# Altium schematic sheet powerS.SchDoc
size A4; DocumentNumber: 2; SheetNumber: 2; SheetTotal: 3
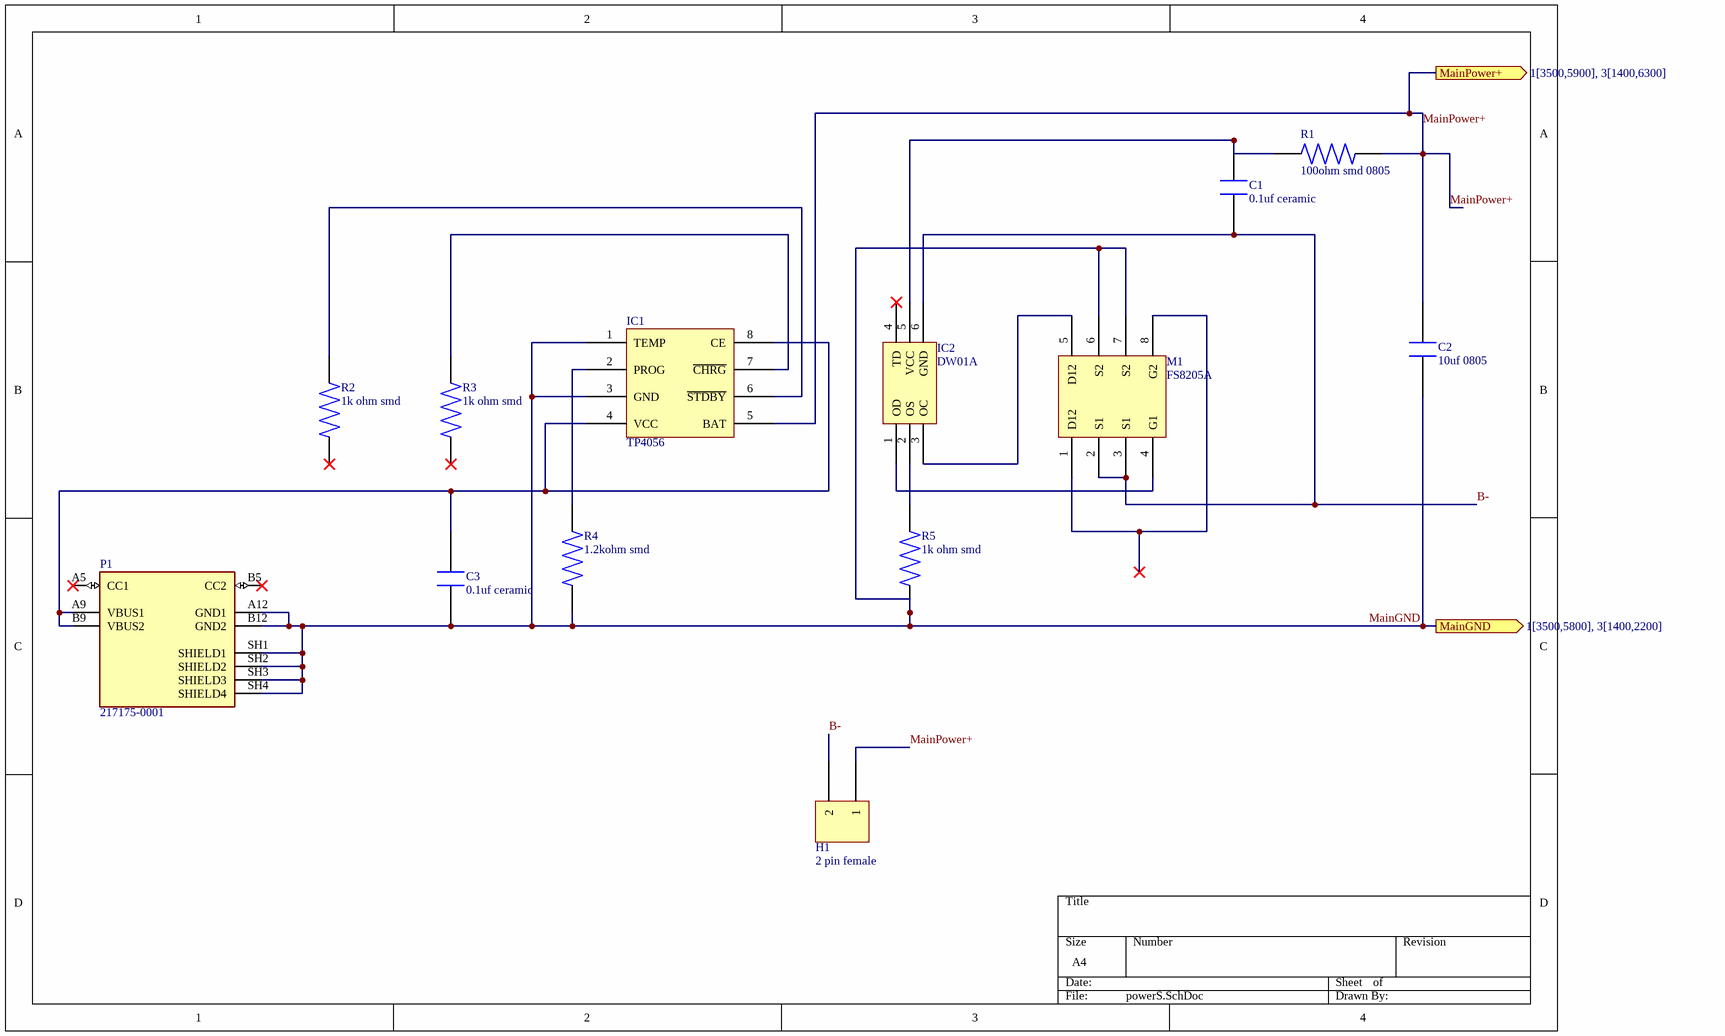
[diagram p0: powerS.SchDoc]

## Parts
C1  0.1uf ceramic  [Capacitor]
C2  10uf 0805  [0805 SMD]
C3  0.1uf ceramic  [Capacitor]
H1  2 pin female  [2 pin female]
IC1  TP4056  [TP 4056]
IC2  DW01A  [DW01]
M1  FS8205A  [FS8205A]
P1  217175-0001  [usb type C]
R1  100ohm smd 0805  [0805 SMD]
R2  1k ohm smd  [0805 SMD]
R3  1k ohm smd  [0805 SMD]
R4  1.2kohm smd  [0805 SMD]
R5  1k ohm smd  [0805 SMD]

## Ports
MainGND (out, see 1[3500,5800], 3[1400,2200]), MainPower+ (out, see 1[3500,5900], 3[1400,6300])

## Nets
B-: C1.1 H1.2 IC2.6(GND) M1.2(S1) M1.3(S1)
MainGND: C2.1 C3.1 IC1.1(TEMP) IC1.3(GND) M1.6(S2) M1.7(S2) P1.A12(GND1) P1.B12(GND2) P1.SH1(SHIELD1) P1.SH2(SHIELD2) P1.SH3(SHIELD3) P1.SH4(SHIELD4) R4.2 R5.1 ; port MainGND
MainPower+: C2.2 H1.1 IC1.5(BAT) R1.2 ; port MainPower+
NetC1_2: C1.2 IC2.5(VCC) R1.1
NetC3_2: C3.2 IC1.4(VCC) IC1.8(CE) P1.A9(VBUS1) P1.B9(VBUS2)
NetIC1_2: IC1.2(PROG) R4.1
NetIC1_6: IC1.6(~{STDBY}) R2.2
NetIC1_7: IC1.7(~{CHRG}) R3.2
NetIC2_1: IC2.1(OD) M1.4(G1)
NetIC2_2: IC2.2(OS) R5.2
NetIC2_3: IC2.3(OC) M1.5(D12)
NetM1_1: M1.1(D12) M1.8(G2)

Not connected (* = marked no-connect by the designer): IC2 4(TD)*; P1 A5(CC1)* B5(CC2)*; R2 1*; R3 1*

## Library data of the parts
C1 C3 = K104K15X7RF5TL2: Ceramic Capacitor, Multilayer, Ceramic, 50V, 10% +Tol, 10% -Tol, X7R, 15% TC, 0.1uF, Through Hole Mount; Manufacturer: Vishay BCcomponents; Value: 100nF; Multilayer: Yes; Supplier: Mouser; Supplier Part Number: 594-K104K15X7RF5TL2; Manufacturer Part Number: K104K15X7RF5TL2; RoHS: Yes; Category: Ceramic Capacitors; Stock: 25637; Pricing: 1=0.25, 10=0.134, 50=0.134, 100=0.093, 1000=0.066, 10000=0.048 (USD); Mounting Technology: Through Hole; Pins: 2; Dielectric Material: Ceramic; Package Shape: Rectangular; Terminal Finish: Tin; Min Operating Temperature: -55°C; Max Operating Temperature: 125°C; JESD-609 Code: e3; Capacitor Type: Ceramic; Tolerance  (fill in as +-): 10%; Package Style: RadialMeter; Packaging: Tape and Reel; Tolerance (fill in as +-): 10%; Rated DC Voltage (URdc): 50V; Temperature Characteristics Code: X7R; Termination: Wire; Length: 4mm; Width: 2.5mm; Height: 5.58mm; Terminal Pitch: 2.5mm; Reach SVHC Compliant: Yes; RoHS Compliant: Yes; ComponentLink1URL: https://datasheet.ciiva.com:443/pdfs/VipMasterIC/IC/VISH/VISHS88539/VISHS88539-1.pdf?src-supplier=IHS+Markit; ComponentLink1Description: https://datasheet.ciiva.com:443/pdfs/VipMasterIC/IC/VISH/VISHS88539/VISHS88539-1.pdf?src-supplier=IHS+Markit; ComponentLink2URL: https://datasheet.ciiva.com/5711/5950-5711596.pdf?src-supplier=Farnell; ComponentLink2Description: https://datasheet.ciiva.com/5711/5950-5711596.pdf?src-supplier=Farnell; ComponentLink3URL: https://datasheet.ciiva.com/3777/kseries-3777922.pdf?src-supplier=Arrow+Electronics; ComponentLink3Description: https://datasheet.ciiva.com/3777/kseries-3777922.pdf?src-supplier=Arrow+Electronics; ComponentLink4URL: https://datasheet.ciiva.com/15165/getdatasheetpartid-35651-15165099.pdf?src-supplier=Verical; ComponentLink4Description: https://datasheet.ciiva.com/15165/getdatasheetpartid-35651-15165099.pdf?src-supplier=Verical; ComponentLink5URL: https://datasheet.ciiva.com/145/kseries-145889.pdf?src-supplier=Digikey; ComponentLink5Description: https://datasheet.ciiva.com/145/kseries-145889.pdf?src-supplier=Digikey; ComponentLink6URL: https://datasheet.ciiva.com/145/kseries-145890.pdf?src-supplier=Digikey; ComponentLink6Description: https://datasheet.ciiva.com/145/kseries-145890.pdf?src-supplier=Digikey; ComponentLink7URL: https://datasheet.ciiva.com/5390/mkseries-205465-5390374.pdf?src-supplier=Mouser; ComponentLink7Description: https://datasheet.ciiva.com/5390/mkseries-205465-5390374.pdf?src-supplier=Mouser; ComponentLink8URL: https://datasheet.ciiva.com/7974/5950-7974781.pdf?src-supplier=Element14; ComponentLink8Description: https://datasheet.ciiva.com/7974/5950-7974781.pdf?src-supplier=Element14; ComponentLink9URL: https://datasheet.ciiva.com/18446/70121924-18446217.pdf?src-supplier=Allied+Electronics; ComponentLink9Description: https://datasheet.ciiva.com/18446/70121924-18446217.pdf?src-supplier=Allied+Electronics
C2 = GRM21BR61C106KE15K: Ceramic Capacitor, Multilayer, Ceramic, 16V, 10% +Tol, 10% -Tol, X5R, 15% TC, 10uF, Surface Mount, 0805; Manufacturer: Murata; Multilayer: Yes; Supplier: Mouser; Supplier Part Number: 81-GRM21BR61C106KE5K; Manufacturer Part Number: GRM21BR61C106KE15K; RoHS: Yes; Category: Ceramic Capacitors; Stock: 207282; Pricing: 1=0.14, 10=0.073, 50=0.073, 100=0.044, 1000=0.03, 10000=0.019 (USD); Mounting Technology: Surface Mount; Pins: 2; Dielectric Material: Ceramic; Package Shape: Rectangular; Case/Package: 0805; Terminal Finish: Nickel; Min Operating Temperature: -55°C; Max Operating Temperature: 85°C; JESD-609 Code: e3; Value: 10uF; Capacitor Type: Ceramic; Tolerance  (fill in as +-): 10%; Package Style: SMTMeter; Packaging: Tape and Reel; Tolerance (fill in as +-): 10%; Rated DC Voltage (URdc): 16V; Temperature Characteristics Code: X5R; Termination: Wraparound; Length: 2mm; Width: 1.25mm; Height: 1.25mm; Reach SVHC Compliant: Yes; RoHS Compliant: Yes; ComponentLink1URL: https://psearch.en.murata.com:443/capacitor/product/GRM21BR61C106KE15%23.pdf?src-supplier=IHS+Markit; ComponentLink1Description: https://psearch.en.murata.com:443/capacitor/product/GRM21BR61C106KE15%23.pdf?src-supplier=IHS+Markit; ComponentLink2URL: https://datasheet.ciiva.com/26822/getdatasheetpartid-31687-26822939.pdf?src-supplier=Verical; ComponentLink2Description: https://datasheet.ciiva.com/26822/getdatasheetpartid-31687-26822939.pdf?src-supplier=Verical; ComponentLink3URL: https://datasheet.ciiva.com/5414/product-5414934.pdf?src-supplier=Mouser; ComponentLink3Description: https://datasheet.ciiva.com/5414/product-5414934.pdf?src-supplier=Mouser; ComponentLink4URL: https://datasheet.ciiva.com/6270/partnumbering-e-01-6270407.pdf?src-supplier=Digikey; ComponentLink4Description: https://datasheet.ciiva.com/6270/partnumbering-e-01-6270407.pdf?src-supplier=Digikey; ComponentLink5URL: https://datasheet.ciiva.com/6270/partnumbering-e-01-6270410.pdf?src-supplier=Digikey; ComponentLink5Description: https://datasheet.ciiva.com/6270/partnumbering-e-01-6270410.pdf?src-supplier=Digikey; ComponentLink6URL: https://datasheet.ciiva.com/6270/partnumbering-e-01-6270412.pdf?src-supplier=Digikey; ComponentLink6Description: https://datasheet.ciiva.com/6270/partnumbering-e-01-6270412.pdf?src-supplier=Digikey
H1 = 22-02-2025: Board Connector, 2 Contact(s), 1 Row(s), Female, Straight, 0.1 inch Pitch, Solder Terminal, Plug; Manufacturer: Molex; Option: General Purpose; Board Mounting Option: PCB EDGE LOCKING HOOK; Contact Pattern: RECTANGULAR; Contact Resistance: 20mR; Contact Style: BELLOWED TYPE; Dielectric Withstanding Voltage (AC): 250V; Durability: 25Cycles; Filter Feature: No; Insertion Force-Max: 2.502N; Insulation Resistance: 500GR; Mating Information: MULTIPLE MATING PARTS AVAILABLE; Number Of Connectors: 1; Rated Current (Signal): 2.5A; Number of Contacts: 2; Withdrawl Force-Min: 0.834N; Body Breadth: 0.318inch; Body Depth: 0.31inch; Body Length: 0.196inch; Reference Standard: UL; Reliability: COMMERCIAL; Supplier: Mouser; Supplier Part Number: 538-22-02-2025; Manufacturer Part Number: 22-02-2025; RoHS: Yes; Category: Headers and Wire Housings; Stock: 7398; Pricing: 1=0.28, 10=0.242, 50=0.206, 100=0.188, 1000=0.157, 10000=0.123 (USD); Mounting Technology: Board; Contact Finish - Mating: NOT SPECIFIED; Insulation Material: Nylon; Min Operating Temperature: -40°C; Max Operating Temperature: 105°C; Connector Type: BOARD CONNECTOR; Body/Shell Style: PLUG; Contact Gender: Female; Mixed Contacts: No; Mounting Style: STRAIGHT; Number Of PCB Rows: 1; Number of Rows Loaded: 1; PCB Contact Pattern: RECTANGULAR; Termination: Solder; Mating Contact Pitch: 0.1inch; Terminal Length: 0.133inch; Terminal Pitch: 2.54mm; Flammability Rating: UL94 V-0; DIN Conformance: No; IEC Conformance: No; MIL Conformance: No; Reach SVHC Compliant: Yes; RoHS Compliant: Yes; ComponentLink1URL: https://datasheet.ciiva.com:443/pdfs/VipMasterIC/IC/MOLE/MOLE-S-A0003536749/MOLE-S-A0003534645-1.pdf?src-supplier=IHS+Markit; ComponentLink1Description: https://datasheet.ciiva.com:443/pdfs/VipMasterIC/IC/MOLE/MOLE-S-A0003536749/MOLE-S-A0003534645-1.pdf?src-supplier=IHS+Markit; ComponentLink2URL: https://datasheet.ciiva.com/15175/getdatasheetpartid-31375-15175253.pdf?src-supplier=Verical; ComponentLink2Description: https://datasheet.ciiva.com/15175/getdatasheetpartid-31375-15175253.pdf?src-supplier=Verical; ComponentLink3URL: https://datasheet.ciiva.com/30151/52630022022025-pcb-receptacles-30151741.pdf?src-supplier=Onlinecomponents.com; ComponentLink3Description: https://datasheet.ciiva.com/30151/52630022022025-pcb-receptacles-30151741.pdf?src-supplier=Onlinecomponents.com
IC1 = TP4057: Manufacturer: Revvo; Supplier: Digikey; Supplier Part Number: 5272-TP4057CT-ND; Manufacturer Part Number: TP4057; RoHS: No; Stock: 1917; Pricing: 1=0.45, 10=0.269, 25=0.2196, 100=0.1645, 250=0.13732, 500=0.1206, 1000=0.10656 (USD)
IC2 = CDSOT236-0504C: Trans Voltage Suppressor Diode, 5V V(RWM), Unidirectional, 1 Element, Silicon; Manufacturer: Bourns; Package Body Material: Plastic; Min Breakdown Voltage: 6V; Number of Elements: 1; Qualification Status: Not Qualified; Supplier: Digikey; Supplier Part Number: CDSOT236-0504CCT-ND; Manufacturer Part Number: CDSOT236-0504C; RoHS: Yes; Category: TVS Diodes; Stock: 7352; Pricing: 1=1.33, 10=1.05, 100=0.738, 500=0.569, 1000=0.549 (USD); Pins: 6; Diode Element Material: SILICON; Package Shape: Rectangular; Terminal Finish: Tin; JESD-609 Code: e3; Polarity: Unidirectional; Diode Type: TRANS VOLTAGE SUPPRESSOR; JESD-30 Code: R-PDSO-G6; Moisture Sensitivity Level: 1; Package Style: SMALL OUTLINEMeter; Rep Pk Reverse Voltage-Max: 5V; Surface Mount: Yes; Technology: AVALANCHE; Terminal Form: Gull Wing; Terminal Position: DUAL; Reach SVHC Compliant: Yes; RoHS Compliant: Yes; ComponentLink1URL: https://datasheet.ciiva.com:443/pdfs/VipMasterIC/IC/BOUR/BOUR-S-A0008954902/BOUR-S-A0008954902-1.pdf?src-supplier=IHS+Markit; ComponentLink1Description: https://datasheet.ciiva.com:443/pdfs/VipMasterIC/IC/BOUR/BOUR-S-A0008954902/BOUR-S-A0008954902-1.pdf?src-supplier=IHS+Markit; ComponentLink2URL: https://datasheet.ciiva.com/4510/cdsot236-0504c-29206-4510980.pdf?src-supplier=Mouser; ComponentLink2Description: https://datasheet.ciiva.com/4510/cdsot236-0504c-29206-4510980.pdf?src-supplier=Mouser; ComponentLink3URL: https://datasheet.ciiva.com/11193/cdsot236-0504c-11193748.pdf?src-supplier=Avnet; ComponentLink3Description: https://datasheet.ciiva.com/11193/cdsot236-0504c-11193748.pdf?src-supplier=Avnet; ComponentLink4URL: https://datasheet.ciiva.com/1281/1-1281335.pdf?src-supplier=Farnell; ComponentLink4Description: https://datasheet.ciiva.com/1281/1-1281335.pdf?src-supplier=Farnell; ComponentLink5URL: https://datasheet.ciiva.com/6574/cdsot236-0504c-6574181.pdf?src-supplier=Digikey; ComponentLink5Description: https://datasheet.ciiva.com/6574/cdsot236-0504c-6574181.pdf?src-supplier=Digikey; ComponentLink6URL: https://datasheet.ciiva.com/6574/cdsot236-0504c-6574182.pdf?src-supplier=Digikey; ComponentLink6Description: https://datasheet.ciiva.com/6574/cdsot236-0504c-6574182.pdf?src-supplier=Digikey; ComponentLink7URL: https://datasheet.ciiva.com/15186/getdatasheetpartid-569616-15186666.pdf?src-supplier=Verical; ComponentLink7Description: https://datasheet.ciiva.com/15186/getdatasheetpartid-569616-15186666.pdf?src-supplier=Verical; ComponentLink8URL: https://datasheet.ciiva.com/1276/1-1276716.pdf?src-supplier=Element14; ComponentLink8Description: https://datasheet.ciiva.com/1276/1-1276716.pdf?src-supplier=Element14; ComponentLink9URL: https://datasheet.ciiva.com/6574/cdsot236-0504c-6574183.pdf?src-supplier=Digikey; ComponentLink9Description: https://datasheet.ciiva.com/6574/cdsot236-0504c-6574183.pdf?src-supplier=Digikey
M1 = FDMQ8205A: Small Signal Field-Effect Transistor, 1.7A I(D), 4-Element, N-Channel and P-Channel, Silicon, Metal-oxide Semiconductor FET; Manufacturer: ON Semiconductor / Fairchild; Supplier: Digikey; Supplier Part Number: FDMQ8205AOSCT-ND; Manufacturer Part Number: FDMQ8205A; RoHS: Yes; Category: Uncategorized; Stock: 2203; Pricing: 1=4.3, 10=2.833, 100=2.0004, 500=1.64488, 1000=1.5307 (USD); ComponentLink1URL: https://datasheet.ciiva.com:443/pdfs/VipMasterIC/IC/ONSM/ONSM-S-A0003590974/ONSM-S-A0003590675-1.pdf?src-supplier=IHS+Markit; ComponentLink1Description: https://datasheet.ciiva.com:443/pdfs/VipMasterIC/IC/ONSM/ONSM-S-A0003590974/ONSM-S-A0003590675-1.pdf?src-supplier=IHS+Markit; ComponentLink2URL: http://www.farnell.com/datasheets/2724479.pdf?src-supplier=Farnell; ComponentLink2Description: http://www.farnell.com/datasheets/2724479.pdf?src-supplier=Farnell; ComponentLink3URL: http://www.onsemi.com/pub/Collateral/FDMQ8205A-D.pdf?src-supplier=Digikey; ComponentLink3Description: http://www.onsemi.com/pub/Collateral/FDMQ8205A-D.pdf?src-supplier=Digikey; ComponentLink4URL: http://www.farnell.com/datasheets/2724479.pdf?src-supplier=Newark; ComponentLink4Description: http://www.farnell.com/datasheets/2724479.pdf?src-supplier=Newark
P1 = 217175-0001: USB Type C - Connector, Top-mount, SMT, 6pos | Molex Incorporated 217175-0001; Supplier: Arrow Electronics; Supplier Part Number: 217175-0001; Manufacturer: Molex; Manufacturer Part Number: 217175-0001; RoHS: No; Category: Connectors; Stock: 4503; Pricing: 1=0.7777, 10=0.6391, 25=0.5562, 100=0.5234, 250=0.4834, 500=0.4331, 1000=0.3654, 4000=0.3393 (USD)
R1 = ERJ-6ENF1000V: Fixed Resistor, Metal Glaze/thick Film, 0.125W, 100ohm, 150V, 1% +/-Tol, 100ppm/Cel, Surface Mount, 0805; Manufacturer: Panasonic; Power: 125mW; Rated Temperature: 70°C; Value: 100R; Temperature Coefficient (ppm/Cel): 100; Package Height: 0.6mm; Package Length: 2mm; Package Width: 1.25mm; Reference Standard: AEC-Q200; Supplier: Mouser; Supplier Part Number: 667-ERJ-6ENF1000V; Manufacturer Part Number: ERJ-6ENF1000V; RoHS: Yes; Category: Chip SMD Resistors; Stock: 326427; Pricing: 1=0.11, 10=0.053, 50=0.053, 100=0.028, 1000=0.017, 10000=0.01 (USD); Mounting Technology: Surface Mount; Pins: 2; Package Shape: Rectangular; Case/Package: 0805; Terminal Finish: Nickel; Min Operating Temperature: -55°C; Max Operating Temperature: 155°C; Tolerance: 1%; JESD-609 Code: e3; Resistor Type: FIXED RESISTOR; Construction: Rectangular; Packaging: Tape and Reel; Technology: METAL GLAZE/THICK FILM; Termination: Wraparound; Working Voltage: 150V; Reach SVHC Compliant: Yes; RoHS Compliant: Yes; ComponentLink1URL: https://datasheet.ciiva.com:443/pdfs/VipMasterIC/IC/PANA/PANA-S-A0009889626/PANA-S-A0009889626-1.pdf?src-supplier=IHS+Markit; ComponentLink1Description: https://datasheet.ciiva.com:443/pdfs/VipMasterIC/IC/PANA/PANA-S-A0009889626/PANA-S-A0009889626-1.pdf?src-supplier=IHS+Markit; ComponentLink2URL: https://datasheet.ciiva.com/11808/0900766b80f80784-11808206.pdf?src-supplier=Rs; ComponentLink2Description: https://datasheet.ciiva.com/11808/0900766b80f80784-11808206.pdf?src-supplier=Rs; ComponentLink3URL: https://datasheet.ciiva.com/9186/aoa0000ce2-9186686.pdf?src-supplier=Avnet; ComponentLink3Description: https://datasheet.ciiva.com/9186/aoa0000ce2-9186686.pdf?src-supplier=Avnet; ComponentLink4URL: https://datasheet.ciiva.com/30154/aoa0000ce2-30154938.pdf?src-supplier=Onlinecomponents.com; ComponentLink4Description: https://datasheet.ciiva.com/30154/aoa0000ce2-30154938.pdf?src-supplier=Onlinecomponents.com; ComponentLink5URL: https://datasheet.ciiva.com/46419/1678782-46419878.pdf?src-supplier=Element14; ComponentLink5Description: https://datasheet.ciiva.com/46419/1678782-46419878.pdf?src-supplier=Element14; ComponentLink6URL: https://datasheet.ciiva.com/7830/426256-7830744.pdf?src-supplier=Element14; ComponentLink6Description: https://datasheet.ciiva.com/7830/426256-7830744.pdf?src-supplier=Element14; ComponentLink7URL: https://datasheet.ciiva.com/7830/1678782-7830986.pdf?src-supplier=Element14; ComponentLink7Description: https://datasheet.ciiva.com/7830/1678782-7830986.pdf?src-supplier=Element14; ComponentLink8URL: https://datasheet.ciiva.com/16765/70260748-16765594.pdf?src-supplier=Allied+Electronics; ComponentLink8Description: https://datasheet.ciiva.com/16765/70260748-16765594.pdf?src-supplier=Allied+Electronics
R2 R3 R5 = RNCP0805FTD1K00: Fixed Resistor, Thin Film, 0.25W, 1000ohm, 200V, 1% +/-Tol, 100ppm/Cel, Surface Mount, 0805; Manufacturer: Stackpole Electronics; Additional Feature: ANTI-SULFUR; Power: 250mW; Rated Temperature: 70°C; Value: 1kR; Temperature Coefficient (ppm/Cel): 100; Package Height: 0.5mm; Package Length: 2mm; Package Width: 1.25mm; Supplier: Digikey; Supplier Part Number: RNCP0805FTD1K00CT-ND; Manufacturer Part Number: RNCP0805FTD1K00; RoHS: Yes; Category: Chip SMD Resistors; Stock: 258243; Pricing: 1=0.1, 10=0.015, 50=0.013, 100=0.0101 (USD); Mounting Technology: Surface Mount; Pins: 2; Package Shape: Rectangular; Case/Package: 0805; Terminal Finish: Nickel; Min Operating Temperature: -55°C; Max Operating Temperature: 155°C; Tolerance: 1%; JESD-609 Code: e3; Resistor Type: FIXED RESISTOR; Construction: Chip; Packaging: Tape and Reel; Technology: THIN FILM; Termination: Wraparound; Working Voltage: 200V; Reach SVHC Compliant: Yes; RoHS Compliant: Yes; ComponentLink1URL: https://datasheet.ciiva.com:443/pdfs/VipMasterIC/IC/SEIE/SEIE-S-A0009893778/SEIE-S-A0009893778-1.pdf?src-supplier=IHS+Markit; ComponentLink1Description: https://datasheet.ciiva.com:443/pdfs/VipMasterIC/IC/SEIE/SEIE-S-A0009893778/SEIE-S-A0009893778-1.pdf?src-supplier=IHS+Markit; ComponentLink2URL: http://www.seielect.com/Catalog/SEI-rncp.pdf?src-supplier=Future+Electronics; ComponentLink2Description: http://www.seielect.com/Catalog/SEI-rncp.pdf?src-supplier=Future+Electronics; ComponentLink3URL: https://www.seielect.com/catalog/SEI-Packaging.pdf?src-supplier=Digikey; ComponentLink3Description: https://www.seielect.com/catalog/SEI-Packaging.pdf?src-supplier=Digikey; ComponentLink4URL: https://www.seielect.com/Catalog/SEI-rncp.pdf?src-supplier=Digikey; ComponentLink4Description: https://www.seielect.com/Catalog/SEI-rncp.pdf?src-supplier=Digikey
R4 = CRGCQ0805F1K2: Fixed Resistor, Metal Glaze/thick Film, 0.125W, 1200ohm, 150V, 1% +/-Tol, 100ppm/Cel, Surface Mount, 0805; Manufacturer: TE Connectivity; Supplier: Digikey; Supplier Part Number: A129750CT-ND; Manufacturer Part Number: CRGCQ0805F1K2; RoHS: Yes; Category: Chip SMD Resistors; Stock: 142199; Pricing: 1=0.1, 10=0.037, 100=0.0186, 1000=0.01059, 2500=0.00902 (USD); Pins: 2; Resistor Type: FIXED RESISTOR; Reach SVHC Compliant: Yes; RoHS Compliant: Yes; ComponentLink1URL: https://datasheet.ciiva.com:443/pdfs/VipMasterIC/IC/TYEL/TYEL-S-A0009522825/TYEL-S-A0009524615-1.pdf?src-supplier=IHS+Markit; ComponentLink1Description: https://datasheet.ciiva.com:443/pdfs/VipMasterIC/IC/TYEL/TYEL-S-A0009522825/TYEL-S-A0009524615-1.pdf?src-supplier=IHS+Markit; ComponentLink2URL: https://4donline.ihs.com/images/VipMasterIC/IC/TYEL/TYEL-S-A0004929575/TYEL-S-A0004929575-1.pdf?hkey=52A5661711E402568146F3353EA87419&src-supplier=Farnell; ComponentLink2Description: https://4donline.ihs.com/images/VipMasterIC/IC/TYEL/TYEL-S-A0004929575/TYEL-S-A0004929575-1.pdf?hkey=52A5661711E402568146F3353EA87419&src-supplier=Farnell; ComponentLink3URL: http://datasheet.octopart.com/CRGCQ0805F1K2-TE-Connectivity-datasheet-114679081.pdf?src-supplier=Verical; ComponentLink3Description: http://datasheet.octopart.com/CRGCQ0805F1K2-TE-Connectivity-datasheet-114679081.pdf?src-supplier=Verical; ComponentLink4URL: http://datasheet.octopart.com/CRGCQ0805F1K2-TE-Connectivity-datasheet-114679081.pdf?src-supplier=Mouser; ComponentLink4Description: http://datasheet.octopart.com/CRGCQ0805F1K2-TE-Connectivity-datasheet-114679081.pdf?src-supplier=Mouser; ComponentLink5URL: http://datasheet.octopart.com/CRGCQ0805F1K2-TE-Connectivity-datasheet-114679081.pdf?src-supplier=Arrow+Electronics; ComponentLink5Description: http://datasheet.octopart.com/CRGCQ0805F1K2-TE-Connectivity-datasheet-114679081.pdf?src-supplier=Arrow+Electronics; ComponentLink6URL: http://datasheet.octopart.com/CRGCQ0805F1K2-TE-Connectivity-datasheet-114679081.pdf?src-supplier=Avnet; ComponentLink6Description: http://datasheet.octopart.com/CRGCQ0805F1K2-TE-Connectivity-datasheet-114679081.pdf?src-supplier=Avnet; ComponentLink7URL: http://datasheet.octopart.com/CRGCQ0805F1K2-TE-Connectivity-datasheet-114679081.pdf?src-supplier=Digikey; ComponentLink7Description: http://datasheet.octopart.com/CRGCQ0805F1K2-TE-Connectivity-datasheet-114679081.pdf?src-supplier=Digikey; ComponentLink8URL: https://www.te.com/commerce/DocumentDelivery/DDEController?Action=srchrtrv&DocNm=1773204-3&DocType=DS&DocLang=English&src-supplier=Digikey; ComponentLink8Description: https://www.te.com/commerce/DocumentDelivery/DDEController?Action=srchrtrv&DocNm=1773204-3&DocType=DS&DocLang=English&src-supplier=Digikey; ComponentLink9URL: http://datasheet.octopart.com/CRGCQ0805F1K2-TE-Connectivity-datasheet-114679081.pdf?src-supplier=Onlinecomponents.com; ComponentLink9Description: http://datasheet.octopart.com/CRGCQ0805F1K2-TE-Connectivity-datasheet-114679081.pdf?src-supplier=Onlinecomponents.com; ComponentLink10URL: http://datasheet.octopart.com/CRGCQ0805F1K2-TE-Connectivity-datasheet-114679081.pdf?src-supplier=Newark; ComponentLink10Description: http://datasheet.octopart.com/CRGCQ0805F1K2-TE-Connectivity-datasheet-114679081.pdf?src-supplier=Newark; ComponentLink11URL: https://4donline.ihs.com/images/VipMasterIC/IC/TYEL/TYEL-S-A0004929575/TYEL-S-A0004929575-1.pdf?hkey=52A5661711E402568146F3353EA87419&src-supplier=Newark; ComponentLink11Description: https://4donline.ihs.com/images/VipMasterIC/IC/TYEL/TYEL-S-A0004929575/TYEL-S-A0004929575-1.pdf?hkey=52A5661711E402568146F3353EA87419&src-supplier=Newark; ComponentLink12URL: http://datasheet.octopart.com/CRGCQ0805F1K2-TE-Connectivity-datasheet-114679081.pdf?src-supplier=Heilind+Electronics; ComponentLink12Description: http://datasheet.octopart.com/CRGCQ0805F1K2-TE-Connectivity-datasheet-114679081.pdf?src-supplier=Heilind+Electronics; ComponentLink13URL: https://datasheet.octopart.com/CRGCQ0805F1K2-TE-Connectivity-datasheet-114679081.pdf?src-supplier=Master+Electronics; ComponentLink13Description: https://datasheet.octopart.com/CRGCQ0805F1K2-TE-Connectivity-datasheet-114679081.pdf?src-supplier=Master+Electronics; ComponentLink14URL: http://datasheet.octopart.com/CRGCQ0805F1K2-TE-Connectivity-datasheet-114679081.pdf?src-supplier=TME; ComponentLink14Description: http://datasheet.octopart.com/CRGCQ0805F1K2-TE-Connectivity-datasheet-114679081.pdf?src-supplier=TME; ComponentLink15URL: http://datasheet.octopart.com/CRGCQ0805F1K2-TE-Connectivity-datasheet-114679081.pdf?src-supplier=Electro+Sonic; ComponentLink15Description: http://datasheet.octopart.com/CRGCQ0805F1K2-TE-Connectivity-datasheet-114679081.pdf?src-supplier=Electro+Sonic; ComponentLink16URL: http://datasheet.octopart.com/CRGCQ0805F1K2-TE-Connectivity-datasheet-114679081.pdf?src-supplier=Sager+Electronics; ComponentLink16Description: http://datasheet.octopart.com/CRGCQ0805F1K2-TE-Connectivity-datasheet-114679081.pdf?src-supplier=Sager+Electronics; ComponentLink17URL: http://datasheet.octopart.com/CRGCQ0805F1K2-TE-Connectivity-datasheet-114679081.pdf?src-supplier=Interstate+Connecting+Components; ComponentLink17Description: http://datasheet.octopart.com/CRGCQ0805F1K2-TE-Connectivity-datasheet-114679081.pdf?src-supplier=Interstate+Connecting+Components